# EAGLE schematic board (EAGLE 8.6.0)
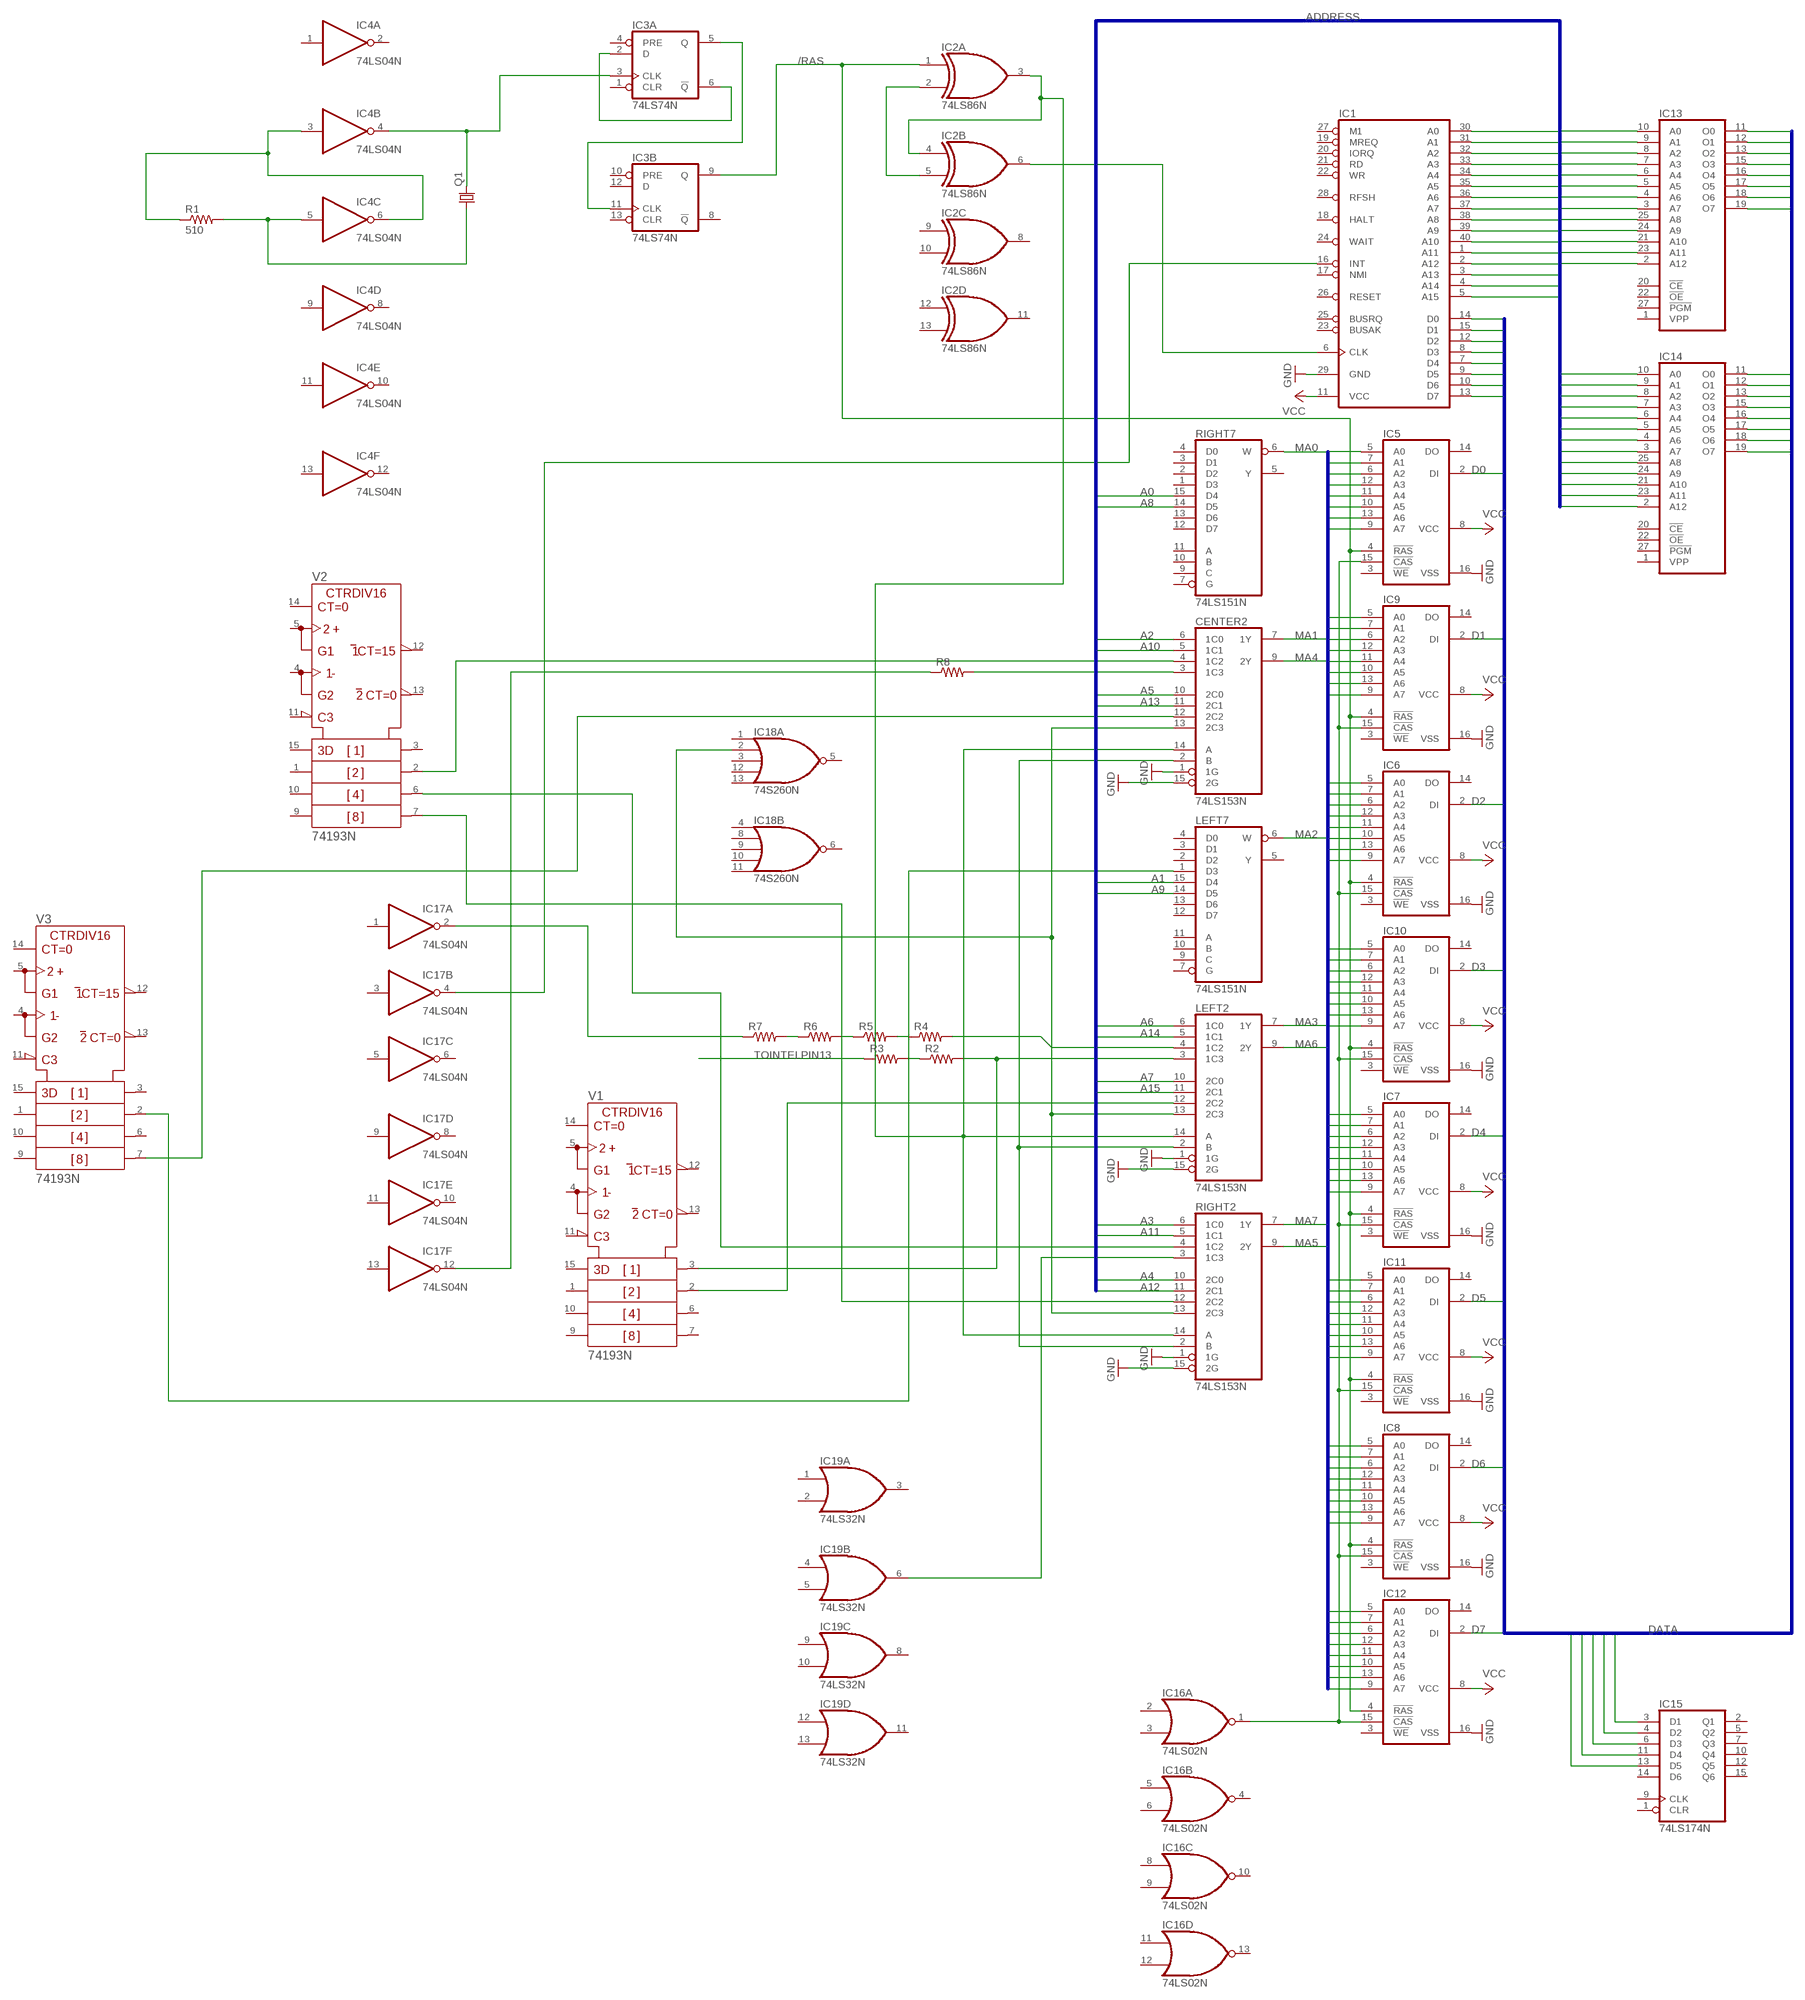
[diagram p0: schematic, sheet 1]

## Parts
CENTER2  74LS153N  [DIL16]
IC1  Z80CPU  [DIL40]
IC2  74LS86N  [DIL14]
IC3  74LS74N  [DIL14]
IC4  74LS04N  [DIL14]
IC5  2164  [DIL16]
IC6  2164  [DIL16]
IC7  2164  [DIL16]
IC8  2164  [DIL16]
IC9  2164  [DIL16]
IC10  2164  [DIL16]
IC11  2164  [DIL16]
IC12  2164  [DIL16]
IC13  2764  [DIL28]
IC14  2764  [DIL28]
IC15  74LS174N  [DIL16]
IC16  74LS02N  [DIL14]
IC17  74LS04N  [DIL14]
IC18  74S260N  [DIL14]
IC19  74LS32N  [DIL14]
LEFT2  74LS153N  [DIL16]
LEFT7  74LS151N  [DIL16]
Q1  CRYSTALHC49S  [HC49/S]
R1  510  R-US_0207/10  [0207/10]
R2  R-US_0207/10  [0207/10]
R3  R-US_0207/10  [0207/10]
R4  R-US_0207/10  [0207/10]
R5  R-US_0207/10  [0207/10]
R6  R-US_0207/10  [0207/10]
R7  R-US_0207/10  [0207/10]
R8  R-US_0207/10  [0207/10]
RIGHT2  74LS153N  [DIL16]
RIGHT7  74LS151N  [DIL16]
V1  74193N  [DIL16]
V2  74193N  [DIL16]
V3  74193N  [DIL16]

## Nets
/RAS: IC2.1(A:I0) IC3.9(B:Q) IC5.4(!RAS) IC6.4(!RAS) IC7.4(!RAS) IC8.4(!RAS) IC9.4(!RAS) IC10.4(!RAS) IC11.4(!RAS) IC12.4(!RAS)
A0: IC1.30(A0) IC13.10(A0) IC14.10(A0) RIGHT7.15(D4)
A1: IC1.31(A1) IC13.9(A1) IC14.9(A1) LEFT7.15(D4)
A2: CENTER2.6(1C0) IC1.32(A2) IC13.8(A2) IC14.8(A2)
A3: IC1.33(A3) IC13.7(A3) IC14.7(A3) RIGHT2.6(1C0)
A4: IC1.34(A4) IC13.6(A4) IC14.6(A4) RIGHT2.10(2C0)
A5: CENTER2.10(2C0) IC1.35(A5) IC13.5(A5) IC14.5(A5)
A6: IC1.36(A6) IC13.4(A6) IC14.4(A6) LEFT2.6(1C0)
A7: IC1.37(A7) IC13.3(A7) IC14.3(A7) LEFT2.10(2C0)
A8: IC1.38(A8) IC13.25(A8) IC14.25(A8) RIGHT7.14(D5)
A9: IC1.39(A9) IC13.24(A9) IC14.24(A9) LEFT7.14(D5)
A10: CENTER2.5(1C1) IC1.40(A10) IC13.21(A10) IC14.21(A10)
A11: IC1.1(A11) IC13.23(A11) IC14.23(A11) RIGHT2.5(1C1)
A12: IC1.2(A12) IC13.2(A12) IC14.2(A12) RIGHT2.11(2C1)
A13: CENTER2.11(2C1) IC1.3(A13)
A14: IC1.4(A14) LEFT2.5(1C1)
A15: IC1.5(A15) LEFT2.11(2C1)
D0: IC1.14(D0) IC5.2(DI) IC13.11(O0) IC14.11(O0) IC15.3(D1)
D1: IC1.15(D1) IC9.2(DI) IC13.12(O1) IC14.12(O1) IC15.4(D2)
D2: IC1.12(D2) IC6.2(DI) IC13.13(O2) IC14.13(O2) IC15.6(D3)
D3: IC1.8(D3) IC10.2(DI) IC13.15(O3) IC14.15(O3) IC15.11(D4)
D4: IC1.7(D4) IC7.2(DI) IC13.16(O4) IC14.16(O4) IC15.13(D5)
D5: IC1.9(D5) IC11.2(DI) IC13.17(O5) IC14.17(O5)
D6: IC1.10(D6) IC8.2(DI) IC13.18(O6) IC14.18(O6)
D7: IC1.13(D7) IC12.2(DI) IC13.19(O7) IC14.19(O7)
GND: CENTER2.1(1G) CENTER2.15(2G) IC1.29(GND) IC5.16(VSS) IC6.16(VSS) IC7.16(VSS) IC8.16(VSS) IC9.16(VSS) IC10.16(VSS) IC11.16(VSS) IC12.16(VSS) LEFT2.1(1G) LEFT2.15(2G) RIGHT2.1(1G) RIGHT2.15(2G)
MA0: IC5.5(A0) IC6.5(A0) IC7.5(A0) IC8.5(A0) IC9.5(A0) IC10.5(A0) IC11.5(A0) IC12.5(A0) RIGHT7.6(W)
MA1: CENTER2.7(1Y) IC5.7(A1) IC6.7(A1) IC7.7(A1) IC8.7(A1) IC9.7(A1) IC10.7(A1) IC11.7(A1) IC12.7(A1)
MA2: IC5.6(A2) IC6.6(A2) IC7.6(A2) IC8.6(A2) IC9.6(A2) IC10.6(A2) IC11.6(A2) IC12.6(A2) LEFT7.6(W)
MA3: IC5.12(A3) IC6.12(A3) IC7.12(A3) IC8.12(A3) IC9.12(A3) IC10.12(A3) IC11.12(A3) IC12.12(A3) LEFT2.7(1Y)
MA4: CENTER2.9(2Y) IC5.11(A4) IC6.11(A4) IC7.11(A4) IC8.11(A4) IC9.11(A4) IC10.11(A4) IC11.11(A4) IC12.11(A4)
MA5: IC5.10(A5) IC6.10(A5) IC7.10(A5) IC8.10(A5) IC9.10(A5) IC10.10(A5) IC11.10(A5) IC12.10(A5) RIGHT2.9(2Y)
MA6: IC5.13(A6) IC6.13(A6) IC7.13(A6) IC8.13(A6) IC9.13(A6) IC10.13(A6) IC11.13(A6) IC12.13(A6) LEFT2.9(2Y)
MA7: IC5.9(A7) IC6.9(A7) IC7.9(A7) IC8.9(A7) IC9.9(A7) IC10.9(A7) IC11.9(A7) IC12.9(A7) RIGHT2.7(1Y)
N$1: IC1.6(CLK) IC2.6(B:O)
N$2: IC2.2(A:I1) IC2.5(B:I1)
N$3: CENTER2.14(A) IC2.3(A:O) IC2.4(B:I0) LEFT2.14(A) RIGHT2.14(A)
N$4: IC3.2(A:D) IC3.6(A:!Q)
N$5: IC3.5(A:Q) IC3.11(B:CLK)
N$6: IC3.3(A:CLK) IC4.4(B:O) Q1.2
N$7: IC4.3(B:I) IC4.6(C:O) R1.1
N$8: IC4.5(C:I) Q1.1 R1.2
N$9: IC5.15(!CAS) IC6.15(!CAS) IC7.15(!CAS) IC8.15(!CAS) IC9.15(!CAS) IC10.15(!CAS) IC11.15(!CAS) IC12.15(!CAS) IC16.1(A:O)
N$10: CENTER2.2(B) LEFT2.2(B) RIGHT2.2(B)
N$11: LEFT2.3(1C3) R2.2 V1.3(QA)
N$12: R2.1 R3.2
N$13: LEFT2.4(1C2) R4.2
N$14: R4.1 R5.2
N$15: R5.1 R6.2
N$16: R6.1 R7.2
N$17: IC17.2(A:O) R7.1
N$18: LEFT2.12(2C2) V1.2(QB)
N$19: CENTER2.13(2C3) IC18.2(A:I1) LEFT2.13(2C3) RIGHT2.13(2C3)
N$20: IC1.16(INT) IC17.4(B:O)
N$21: CENTER2.3(1C3) R8.2
N$22: IC17.12(F:O) R8.1
N$23: CENTER2.4(1C2) V2.2(QB)
N$24: IC19.6(B:O) RIGHT2.3(1C3)
N$25: RIGHT2.4(1C2) V2.6(QC)
N$26: CENTER2.12(2C2) V3.7(QD)
N$27: RIGHT2.12(2C2) V2.7(QD)
N$28: LEFT7.1(D3) V3.2(QB)
TOINTELPIN13: R3.1
VCC: IC1.11(VCC) IC5.8(VCC) IC6.8(VCC) IC7.8(VCC) IC8.8(VCC) IC9.8(VCC) IC10.8(VCC) IC11.8(VCC) IC12.8(VCC)
Unconnected: IC1.17(NMI) IC1.18(HALT) IC1.19(MREQ) IC1.20(IORQ) IC1.21(RD) IC1.22(WR) IC1.23(BUSAK) IC1.24(WAIT) IC1.25(BUSRQ) IC1.26(RESET) IC1.27(M1) IC1.28(RFSH) IC2.8(C:O) IC2.9(C:I0) IC2.10(C:I1) IC2.11(D:O) IC2.12(D:I0) IC2.13(D:I1) IC3.1(A:CLR) IC3.4(A:PRE) IC3.8(B:!Q) IC3.10(B:PRE) IC3.12(B:D) IC3.13(B:CLR) IC4.1(A:I) IC4.2(A:O) IC4.8(D:O) IC4.9(D:I) IC4.10(E:O) IC4.11(E:I) IC4.12(F:O) IC4.13(F:I) IC5.3(!WE) IC5.14(DO) IC6.3(!WE) IC6.14(DO) IC7.3(!WE) IC7.14(DO) IC8.3(!WE) IC8.14(DO) IC9.3(!WE) IC9.14(DO) IC10.3(!WE) IC10.14(DO) IC11.3(!WE) IC11.14(DO) IC12.3(!WE) IC12.14(DO) IC13.1(VPP) IC13.20(!CE) IC13.22(!OE) IC13.27(!PGM) IC14.1(VPP) IC14.20(!CE) IC14.22(!OE) IC14.27(!PGM) IC15.1(CLR) IC15.2(Q1) IC15.5(Q2) IC15.7(Q3) IC15.9(CLK) IC15.10(Q4) IC15.12(Q5) IC15.14(D6) IC15.15(Q6) IC16.2(A:I0) IC16.3(A:I1) IC16.4(B:O) IC16.5(B:I0) IC16.6(B:I1) IC16.8(C:I0) IC16.9(C:I1) IC16.10(C:O) IC16.11(D:I0) IC16.12(D:I1) IC16.13(D:O) IC17.1(A:I) IC17.3(B:I) IC17.5(C:I) IC17.6(C:O) IC17.8(D:O) IC17.9(D:I) IC17.10(E:O) IC17.11(E:I) IC17.13(F:I) IC18.1(A:I0) IC18.3(A:I2) IC18.4(B:I0) IC18.5(A:O) IC18.6(B:O) IC18.8(B:I1) IC18.9(B:I2) IC18.10(B:I3) IC18.11(B:I4) IC18.12(A:I3) IC18.13(A:I4) IC19.1(A:I0) IC19.2(A:I1) IC19.3(A:O) IC19.4(B:I0) IC19.5(B:I1) IC19.8(C:O) IC19.9(C:I0) IC19.10(C:I1) IC19.11(D:O) IC19.12(D:I0) IC19.13(D:I1) LEFT7.2(D2) LEFT7.3(D1) LEFT7.4(D0) LEFT7.5(Y) LEFT7.7(G) LEFT7.9(C) LEFT7.10(B) LEFT7.11(A) LEFT7.12(D7) LEFT7.13(D6) RIGHT7.1(D3) RIGHT7.2(D2) RIGHT7.3(D1) RIGHT7.4(D0) RIGHT7.5(Y) RIGHT7.7(G) RIGHT7.9(C) RIGHT7.10(B) RIGHT7.11(A) RIGHT7.12(D7) RIGHT7.13(D6) V1.1(B) V1.4(DOWN) V1.5(UP) V1.6(QC) V1.7(QD) V1.9(D) V1.10(C) V1.11(!LOAD) V1.12(!CO) V1.13(!BO) V1.14(CLR) V1.15(A) V2.1(B) V2.3(QA) V2.4(DOWN) V2.5(UP) V2.9(D) V2.10(C) V2.11(!LOAD) V2.12(!CO) V2.13(!BO) V2.14(CLR) V2.15(A) V3.1(B) V3.3(QA) V3.4(DOWN) V3.5(UP) V3.6(QC) V3.9(D) V3.10(C) V3.11(!LOAD) V3.12(!CO) V3.13(!BO) V3.14(CLR) V3.15(A)

## Buses
ADDRESS
DATA
MA[0..7]

## Power pins joined to a net without a drawn wire
+UB: V1.16(+UB) V2.16(+UB) V3.16(+UB)
-UB: V1.8(-UB) V2.8(-UB) V3.8(-UB)
GND: CENTER2.8(GND) IC2.7(P:GND) IC3.7(P:GND) IC4.7(P:GND) IC13.14(GND) IC14.14(GND) IC15.8(GND) IC16.7(P:GND) IC17.7(P:GND) IC18.7(P:GND) IC19.7(P:GND) LEFT2.8(GND) LEFT7.8(GND) RIGHT2.8(GND) RIGHT7.8(GND)
VCC: CENTER2.16(VCC) IC2.14(P:VCC) IC3.14(P:VCC) IC4.14(P:VCC) IC13.28(VCC) IC14.28(VCC) IC15.16(VCC) IC16.14(P:VCC) IC17.14(P:VCC) IC18.14(P:VCC) IC19.14(P:VCC) LEFT2.16(VCC) LEFT7.16(VCC) RIGHT2.16(VCC) RIGHT7.16(VCC)

## Library data of the parts
CENTER2 LEFT2 RIGHT2 = 74xx-us:74*153: Dual 4-line to 1-line data SELECTOR/MULTIPLEXER
IC1 = zilog:Z80CPU: Z80 FAMILY DEVICE
IC2 = 74xx-us:74*86: Quad 2-input EXCLUSIV-OR (XOR) gate
IC3 = 74xx-us:74*74: Dual D type positive edge triggered FLIP FLOP, preset and clear
IC4 IC17 = 74xx-us:74*04: Hex INVERTER
IC5-IC12 = memory:2164: MEMORY
IC13 IC14 = memory:2764: MEMORY
IC15 = 74xx-us:74*174: Hex D type FLIP FLOP, clear
IC16 = 74xx-us:74*02: Quad 2-input NOR gate
IC18 = 74xx-us:74*260: Dual 5-input positive NOR gate
IC19 = 74xx-us:74*32: Quad 2-input OR gate
LEFT7 RIGHT7 = 74xx-us:74*151: Data SELECTOR/MULTIPLEXER
Q1 = crystal:CRYSTAL: CRYSTAL; OC_FARNELL: 1667008; OC_NEWARK: unknown
R1-R8 = resistor:R-US_: RESISTOR, American symbol
V1-V3 = 74ttl-din:74*193: Synchronus 4-bit up down COUNTER